# EAGLE design Screen v2 (EAGLE 9.2.0)
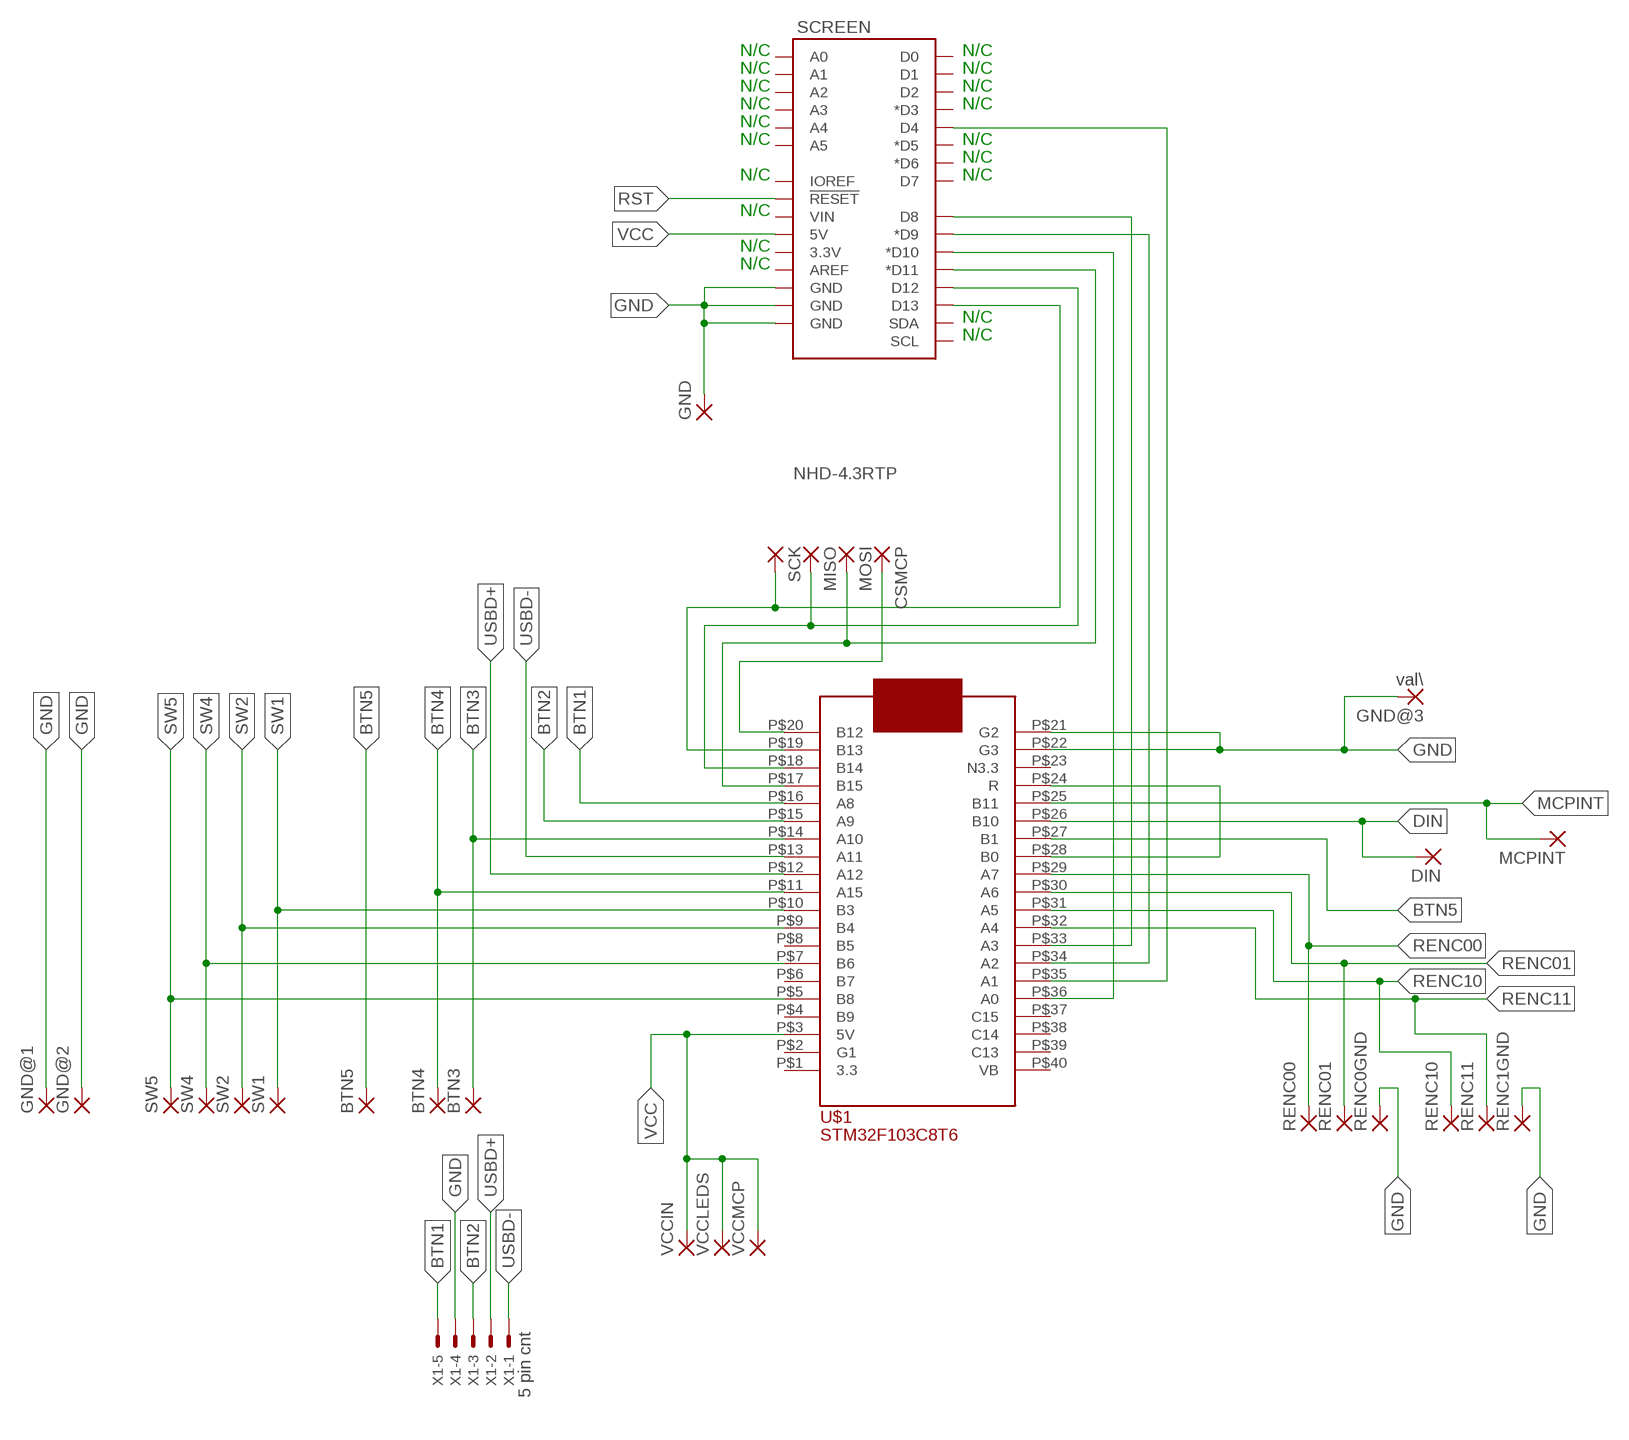
[diagram p0: schematic, sheet 1]

## Parts
BTN3  SMD5  [SMD2,54-5,08]
BTN4  SMD5  [SMD2,54-5,08]
BTN5  SMD5  [SMD2,54-5,08]
CSMCP  SMD5  [SMD2,54-5,08]
DIN  SMD5  [SMD2,54-5,08]
GND  SMD5  [SMD2,54-5,08]
GND@1  SMD5  [SMD2,54-5,08]
GND@2  SMD5  [SMD2,54-5,08]
GND@3  val\  SMD5  [SMD2,54-5,08]
MCPINT  SMD5  [SMD2,54-5,08]
MISO  SMD5  [SMD2,54-5,08]
MOSI  SMD5  [SMD2,54-5,08]
RENC00  SMD5  [SMD2,54-5,08]
RENC0GND  SMD5  [SMD2,54-5,08]
RENC01  SMD5  [SMD2,54-5,08]
RENC1GND  SMD5  [SMD2,54-5,08]
RENC10  SMD5  [SMD2,54-5,08]
RENC11  SMD5  [SMD2,54-5,08]
SCK  SMD5  [SMD2,54-5,08]
SCREEN  NHD-4.3RTP  [NHD-4.3RTP]
SW1  SMD5  [SMD2,54-5,08]
SW2  SMD5  [SMD2,54-5,08]
SW4  SMD5  [SMD2,54-5,08]
SW5  SMD5  [SMD2,54-5,08]
U$1  STM32F103C8T6DIP40  [STM32]
VCCIN  SMD5  [SMD2,54-5,08]
VCCLEDS  SMD5  [SMD2,54-5,08]
VCCMCP  SMD5  [SMD2,54-5,08]
X1  5 pin cnt  JST-XH-05-PIN-ROUND-PAD  [JST-XH-05-PACKAGE-ROUND-PAD]

## Nets
BTN1: U$1.P$16(A8) X1.5
BTN2: U$1.P$15(A9) X1.3
BTN3: BTN3.1(P) U$1.P$14(A10)
BTN4: BTN4.1(P) U$1.P$11(A15)
BTN5: BTN5.1(P) U$1.P$27(B1)
CS_SCREEN: SCREEN.D10(*D10) U$1.P$36(A0)
CSMCP: CSMCP.1(P) U$1.P$20(B12)
DIN: DIN.1(P) U$1.P$26(B10)
GND: GND.1(P) GND@1.1(P) GND@2.1(P) GND@3.1(P) RENC0GND.1(P) RENC1GND.1(P) SCREEN.GND@1(GND) SCREEN.GND@2(GND) SCREEN.GND@3(GND) U$1.P$21(G2) U$1.P$22(G3) X1.4
MCPINT: MCPINT.1(P) U$1.P$25(B11)
MISO: MISO.1(P) SCREEN.D12 U$1.P$18(B14)
MOSI: MOSI.1(P) SCREEN.D11(*D11) U$1.P$17(B15)
N$1: SCREEN.D4 U$1.P$35(A1)
N$2: SCREEN.D9(*D9) U$1.P$34(A2)
N$3: SCREEN.D8 U$1.P$33(A3)
N$13: U$1.P$24(R) U$1.P$28(B0)
RENC00: RENC00.1(P) U$1.P$29(A7)
RENC01: RENC01.1(P) U$1.P$30(A6)
RENC10: RENC10.1(P) U$1.P$31(A5)
RENC11: RENC11.1(P) U$1.P$32(A4)
RST: SCREEN.RESET@1(!RESET!)
SCK: SCK.1(P) SCREEN.D13 U$1.P$19(B13)
SW1: SW1.1(P) U$1.P$10(B3)
SW2: SW2.1(P) U$1.P$9(B4)
SW4: SW4.1(P) U$1.P$7(B6)
SW5: SW5.1(P) U$1.P$5(B8)
USBD+: U$1.P$12(A12) X1.2
USBD-: U$1.P$13(A11) X1.1
VCC: SCREEN.5V U$1.P$3(5V) VCCIN.1(P) VCCLEDS.1(P) VCCMCP.1(P)
Unconnected: SCREEN.3.3V SCREEN.A0 SCREEN.A1 SCREEN.A2 SCREEN.A3 SCREEN.A4 SCREEN.A5 SCREEN.AREF SCREEN.D0 SCREEN.D1 SCREEN.D2 SCREEN.D3(*D3) SCREEN.D5(*D5) SCREEN.D6(*D6) SCREEN.D7 SCREEN.IOREF SCREEN.SCL SCREEN.SDA SCREEN.VIN U$1.P$1(3.3) U$1.P$2(G1) U$1.P$4(B9) U$1.P$6(B7) U$1.P$8(B5) U$1.P$23(N3.3) U$1.P$37(C15) U$1.P$38(C14) U$1.P$39(C13) U$1.P$40(VB)

## Notes on the sheet
- N/C | N/C
- N/C | N/C
- N/C | N/C
- N/C | N/C
- N/C
- N/C | N/C
- N/C
- N/C | N/C
- N/C
- N/C
- N/C
- N/C
- N/C

## Library data of the parts
BTN3-BTN5 CSMCP DIN GND GND@1-GND@3 MCPINT MISO MOSI RENC00 RENC0GND RENC01 RENC1GND RENC10 RENC11 SCK SW1 SW2 SW4 SW5 VCCIN VCCLEDS VCCMCP = wirepad:SMD5: SMD PAD
SCREEN = Components:NHD-4.3RTP: Arduino R3 Footprint with SPI header Arduino Uno R3 Compatible Footprint. Matches PCB size of the original board. SparkFun Products: SAMD21 Dev Breakout <https://www.sparkfun.com/products/13672> RedBoard <https://www.sparkfun.com/products/12757> R3 Stackable Headers <https://www.sparkfun.com/products/11417>
U$1 = Components:STM32F103C8T6
X1 = Rembrandt Electronics - JST XH Connectors v1-0:JST-XH-05-PIN: JST XH Connector 2 Pin Wire to board connector. Pitch: 2,54 mm, (0.100") Number of pins: 5 Created by Rembrandt Electronics www.rembrandtelectronics.com

## Board
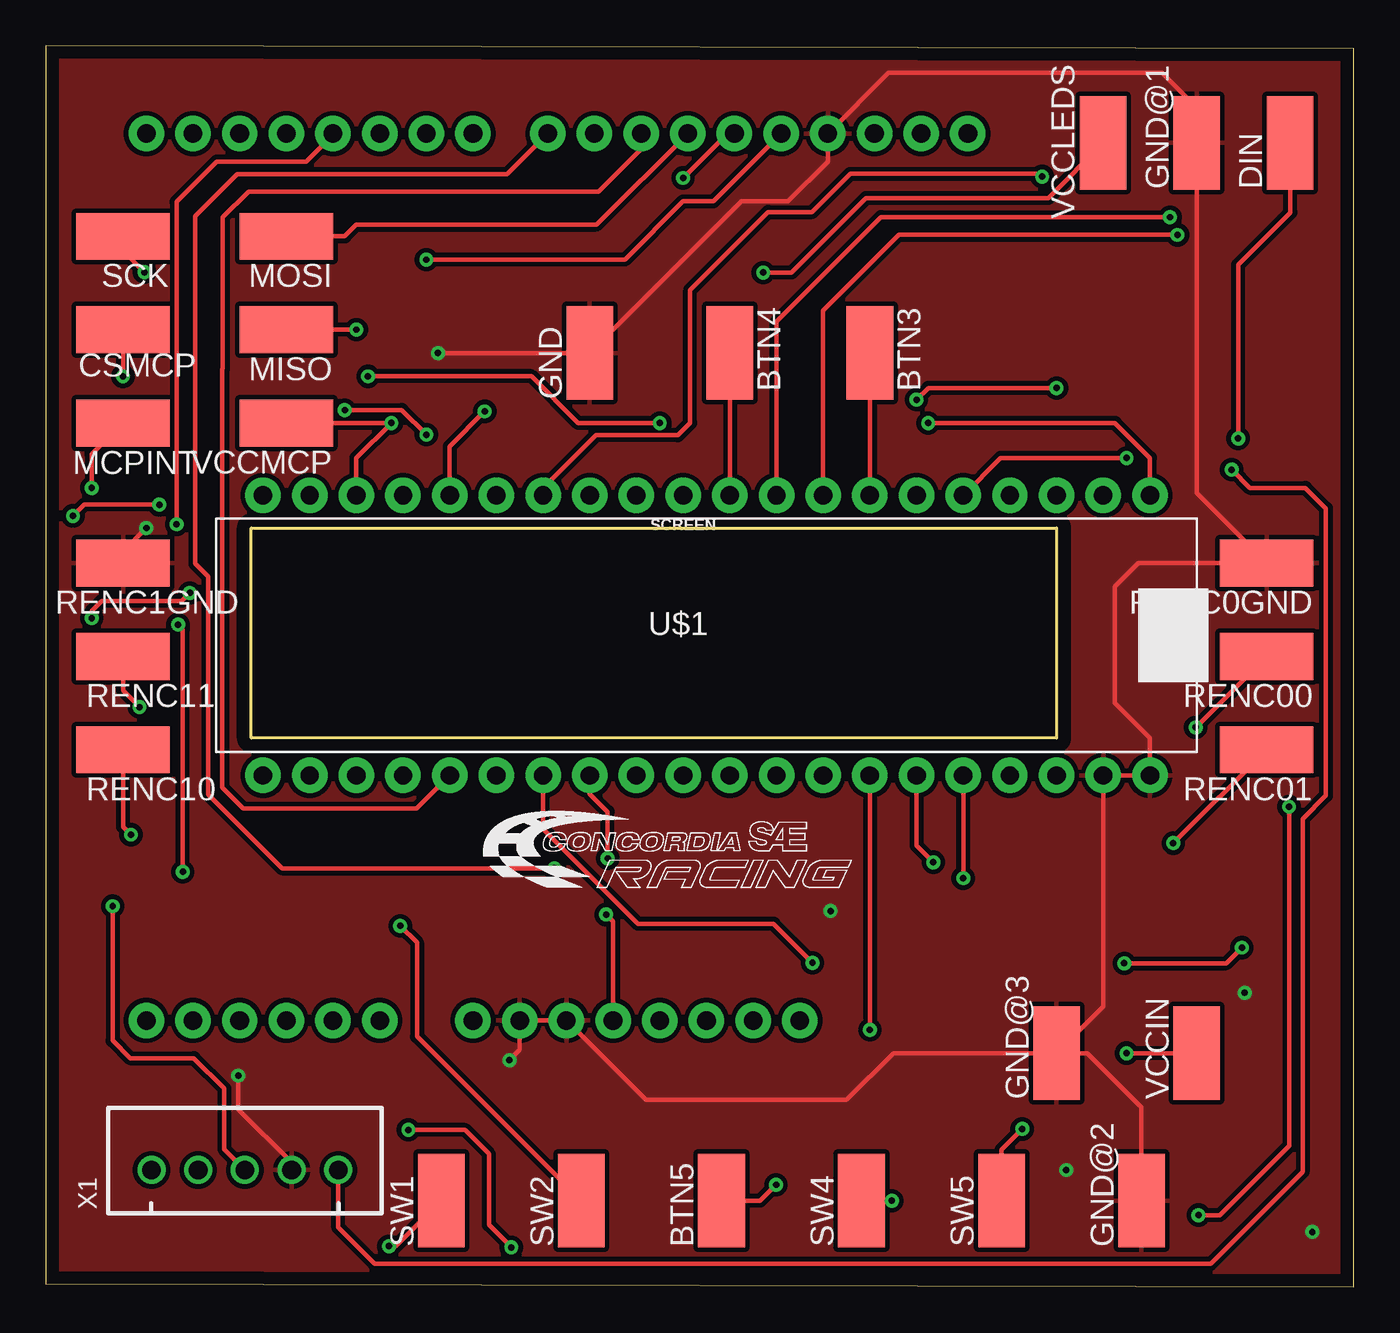
[diagram p1: board, top side]
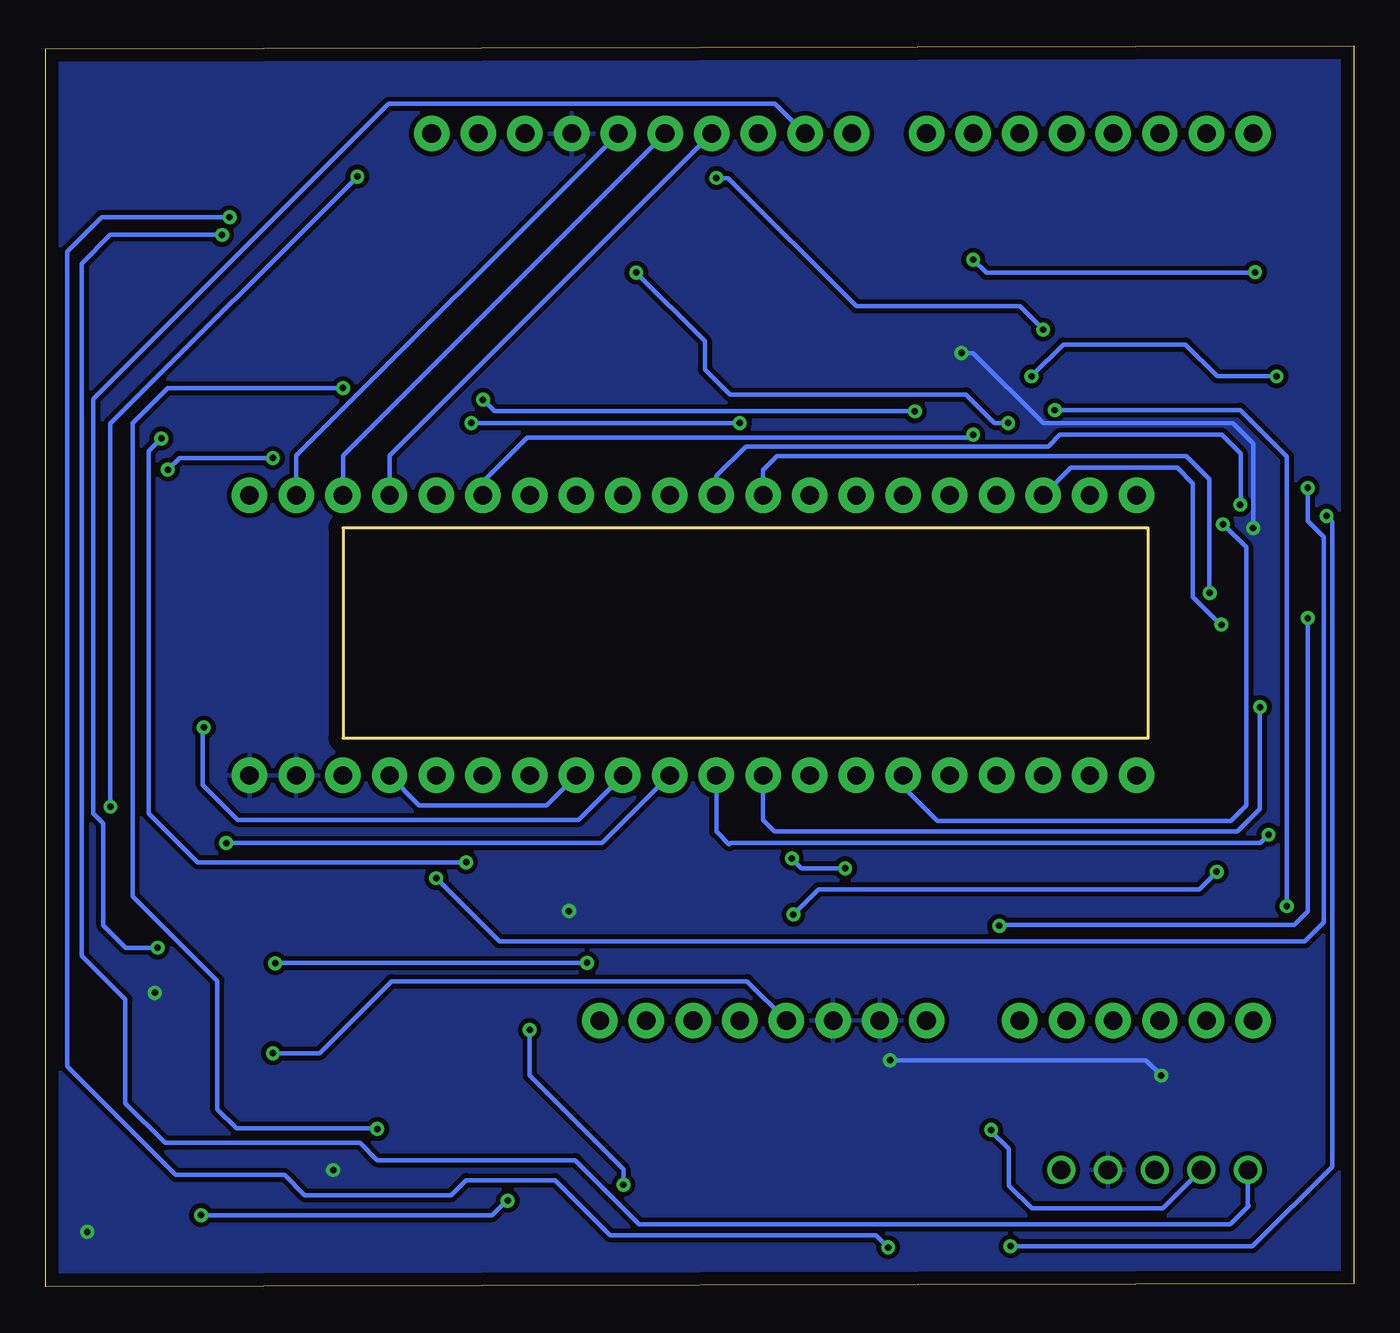
[diagram p2: board, bottom side, seen from below]

Size 71.15 x 67.51 mm. Coordinates in mm from the lower left corner, seen from the top.
Outline: 0,0.16 71.15,0 71.15,67.35 0,67.51 0,0.16
Outline: 11.18,41.27 54.99,41.27 54.99,29.84 11.18,29.84 11.18,41.27
Copper layers (1*16): Top 0.035mm / dielectric 1.5mm / Bottom 0.035mm
Design rules "default *": minimum track width 5mil, minimum drill 0.200659375mm, track to track 5mil, track to pad 5mil, pad to pad 5mil, via to via 5mil, smd to smd 0mil, copper to edge 28mil, drill to drill 6mil, minimum pad ring 10mil, minimum via ring 8mil, stop-mask expansion 5mil, vias tented up to drill 0mil, thermal gap 10mil

### Footprints (pad centres in the part's own frame; a part is rotated, then mirrored left to right if it is on the bottom)
SMD2,54-5,08 = smd 2.54 x 5.08: 1 0,0
NHD-4.3RTP = drill 1.016 pad 1.93: 3.3V 10.16,-24.13; 5V 7.62,-24.13; A0 -5.08,-24.13; A1 -7.62,-24.13; A2 -10.16,-24.13; A3 -12.7,-24.13; A4 -15.24,-24.13; A5 -17.78,-24.13; AREF 21.844,24.13; D0 -17.78,24.13; D1 -15.24,24.13; D2 -12.7,24.13; D3 -10.16,24.13; D4 -7.62,24.13; D5 -5.08,24.13; D6 -2.54,24.13; D7 0,24.13; D8 4.064,24.13; D9 6.604,24.13; D10 9.144,24.13; D11 11.684,24.13; D12 14.224,24.13; D13 16.764,24.13; GND@1 5.08,-24.13; GND@2 2.54,-24.13; GND@3 19.304,24.13; IOREF 15.24,-24.13; NC 17.78,-24.13; RESET@1 12.7,-24.13; SCL 26.924,24.13; SDA 24.384,24.13; VIN 0,-24.13
STM32 = drill 1 pad 1.93: P$1 -7.62,-20.955; P$2 -7.62,-18.415; P$3 -7.62,-15.875; P$4 -7.62,-13.335; P$5 -7.62,-10.795; P$6 -7.62,-8.255; P$7 -7.62,-5.715; P$8 -7.62,-3.175; P$9 -7.62,-0.635; P$10 -7.62,1.905; P$11 -7.62,4.445; P$12 -7.62,6.985; P$13 -7.62,9.525; P$14 -7.62,12.065; P$15 -7.62,14.605; P$16 -7.62,17.145; P$17 -7.62,19.685; P$18 -7.62,22.225; P$19 -7.62,24.765; P$20 -7.62,27.305; P$21 7.62,27.305; P$22 7.62,24.765; P$23 7.62,22.225; P$24 7.62,19.685; P$25 7.62,17.145; P$26 7.62,14.605; P$27 7.62,12.065; P$28 7.62,9.525; P$29 7.62,6.985; P$30 7.62,4.445; P$31 7.62,1.905; P$32 7.62,-0.635; P$33 7.62,-3.175; P$34 7.62,-5.715; P$35 7.62,-8.255; P$36 7.62,-10.795; P$37 7.62,-13.335; P$38 7.62,-15.875; P$39 7.62,-18.415; P$40 7.62,-20.955
JST-XH-05-PACKAGE-ROUND-PAD = drill 1.016: 1 -5.08,0; 2 -2.54,0; 3 0,0; 4 2.54,0; 5 5.08,0

### Placement (x,y rotation side)
BTN3  44.83,50.8 180 top
BTN4  37.21,50.8 180 top
BTN5  36.75,4.67 0 top
CSMCP  4.19,52.07 90 top
DIN  67.69,62.23 0 top
GND  29.59,50.8 0 top
GND@1  62.61,62.23 0 top
GND@2  59.61,4.67 0 top
GND@3  54.99,12.7 0 top
MCPINT  4.19,46.99 90 top
MISO  13.08,52.07 90 top
MOSI  13.08,57.15 90 top
RENC00  66.42,34.29 90 top
RENC0GND  66.42,39.37 90 top
RENC01  66.42,29.21 90 top
RENC1GND  4.19,39.37 90 top
RENC10  4.19,29.21 90 top
RENC11  4.19,34.29 90 top
SCK  4.19,57.15 90 top
SCREEN  23.24,38.61 0 top
SW1  21.51,4.67 0 top
SW2  29.13,4.67 0 top
SW4  44.37,4.67 0 top
SW5  51.99,4.67 0 top
U$1  32.77,35.43 270 top
VCCIN  62.61,12.7 0 top
VCCLEDS  57.53,62.23 0 top
VCCMCP  13.08,46.99 90 top
X1  10.83,6.34 0 top

### Tracks (layer width: path | path; a pad name or v marks a point on that pad's centre or on a via)
BTN1  (via drill 0.35)
  Top 0.254: v58.8,45.08 51.94,45.08 U$1.P$16 | v64.52,44.45 65.51,43.46 68.53,43.46 69.65,42.34 69.65,26.72 68.38,25.45 68.38,6.24 63.38,1.24 17.88,1.24 15.91,3.22 X1.5
  Bottom 0.254: v64.52,44.45 63.88,45.08 v58.8,45.08
BTN2  (via drill 0.35)
  Top 0.254: v16.26,47.69 19.36,47.69 v20.7,46.35 | v3.63,20.7 3.63,13.39 4.6,12.42 8.05,12.42 9.7,10.77 9.7,7.47 X1.3
  Bottom 0.254: U$1.P$15 47.37,43.81 44.98,46.2 20.85,46.2 v20.7,46.35 | v16.26,47.69 6.17,47.69 3.63,45.16 v3.63,20.7
BTN3
  Top 0.254: BTN3.1 U$1.P$14
BTN4
  Top 0.254: BTN4.1 U$1.P$11
BTN5  (via drill 0.35)
  Top 0.254: U$1.P$27 v44.83,13.97 | v39.73,5.54 38.86,4.67 BTN5.1
  Bottom 0.254: v39.73,5.54 39.73,6.38 44.83,11.48 v44.83,13.97
CS_SCREEN
  Top 0.254: SCREEN.D10 32.38,61.9 30.07,59.59 11.02,59.59 9.63,58.19 9.63,49.94 9.6,49.91 9.6,27.15 10.74,26.01 20.17,26.01 U$1.P$36
CSMCP  (via drill 0.35)
  Top 0.254: U$1.P$20 60.07,45.08 58.17,46.99 v48.01,46.99 | v33.4,46.99 28.96,46.99 26.42,49.53 v17.53,49.53 | v4.19,49.53 CSMCP.1
  Bottom 0.254: v48.01,46.99 v33.4,46.99 | v17.53,49.53 15.8,51.26 9.14,51.26 7.42,49.53 v4.19,49.53
DIN  (via drill 0.35)
  Top 0.254: U$1.P$26 47.37,24 v48.29,23.09 | v64.87,46.15 64.87,55.6 67.72,58.45 67.72,62.2 DIN.1
  Bottom 0.254: v48.29,23.09 62.89,23.09 65.56,25.76 65.56,45.47 v64.87,46.15
GND  (via drill 0.35)
  Top 0.254: GND@3.1 46.1,12.7 43.56,10.16 32.64,10.16 SCREEN.GND@1 SCREEN.GND@2 25.78,12.88 v25.22,12.32 | GND@3.1 57.53,15.24 U$1.P$22 U$1.P$21 60.07,29.84 58.17,31.75 58.17,38.1 59.44,39.37 RENC0GND.1 62.61,43.18 GND@1.1 62.61,64.13 60.71,66.04 45.85,66.04 SCREEN.GND@3 42.54,61.21 40.39,59.05 37.85,59.05 GND.1 v21.34,50.8 | v5.46,41.27 4.19,40 RENC1GND.1 | GND@2.1 59.61,9.75 56.67,12.7 GND@3.1 | v10.46,11.48 10.46,9.66 13.37,6.76 X1.4
  Bottom 0.254: v21.34,50.8 20.7,50.8 16.89,46.99 6.58,46.99 5.46,45.87 v5.46,41.27 | v25.22,12.32 11.3,12.32 v10.46,11.48
  other vias: 42.69,20.43 55.51,6.34 65.22,15.99 68.91,2.97
  pour Bottom (isolate 0.254): -10.11,76.32 -10.11,-10.04 81.33,-10.04 81.33,76.32
  pour Top (isolate 0.254): -5.03,71.24 -5.03,-4.96 76.25,-4.96 76.25,71.24
MCPINT  (via drill 0.35)
  Top 0.254: v49.91,22.22 U$1.P$25 | MCPINT.1 2.49,45.29 v2.49,43.46
  Bottom 0.254: v49.91,22.22 46.47,18.79 2.65,18.79 1.63,19.81 1.63,40.79 2.49,41.66 v2.49,43.46
MISO  (via drill 0.35)
  Top 0.254: SCREEN.D12 37.08,62.74 v34.67,60.32 | v16.89,52.07 MISO.1
  Bottom 0.254: v34.67,60.32 34.04,60.32 27.05,53.34 18.16,53.34 v16.89,52.07 | SCREEN.D12 54.99,45.21 U$1.P$18
MOSI
  Top 0.254: MOSI.1 16.26,57.15 16.89,57.78 29.97,57.78 SCREEN.D11
  Bottom 0.254: SCREEN.D11 52.45,45.21 U$1.P$17
N$1  (via drill 0.35)
  Top 0.254: SCREEN.D4 15.62,62.69 14.15,61.21 9.3,61.21 7.11,59.03 v7.11,41.48
  Bottom 0.254: U$1.P$35 24.51,27.2 22.66,25.35 6.68,25.35 5.85,26.18 5.85,40.24 7.09,41.48 v7.11,41.48
N$2  (via drill 0.35)
  Top 0.254: v41.71,17.62 39.59,19.74 32.21,19.74 27.05,24.89 U$1.P$34 | v58.67,17.59 64.23,17.59 v65.07,18.44
  Bottom 0.254: v58.67,17.59 58.65,17.62 v41.71,17.62 | SCREEN.D9 31.47,64.36 52.5,64.36 68.58,48.29 68.58,25.76 68.02,25.2 68.02,19.66 66.8,18.44 v65.07,18.44
N$3  (via drill 0.35)
  Top 0.254: SCREEN.D8 25.09,60.53 10.41,60.53 8.13,58.24 8.13,39.33 8.83,38.63 8.83,26.78 12.85,22.76 v27.66,22.76 | v30.57,23.3 30.57,25.83 29.59,26.81 U$1.P$33
  Bottom 0.254: v27.66,22.76 30.03,22.76 v30.57,23.3
N$13
  Bottom 0.254: U$1.P$28 43.91,26.19 50.84,26.19 U$1.P$24
RENC00  (via drill 0.35)
  Top 0.254: v62.56,30.43 RENC00.1
  Bottom 0.254: U$1.P$29 42.16,25.4 60.71,25.4 62.61,27.3 62.61,30.38 v62.56,30.43
RENC01  (via drill 0.35)
  Top 0.254: v61.34,24.13 RENC01.1
  Bottom 0.254: v61.34,24.13 40.89,24.13 U$1.P$30
RENC10  (via drill 0.35)
  Top 0.254: v4.63,24.59 4.19,25.02 RENC10.1
  Bottom 0.254: U$1.P$31 34.67,24.76 33.97,24.07 33.91,24.13 5.08,24.13 v4.63,24.59
RENC11  (via drill 0.35)
  Top 0.254: v5.09,31.53 4.19,32.43 RENC11.1
  Bottom 0.254: U$1.P$32 32.13,25.4 31.5,24.76 6.32,24.76 5.09,26 v5.09,31.53
SCK  (via drill 0.35)
  Top 0.254: v20.7,55.88 31.5,55.88 34.67,59.05 36.32,59.05 SCREEN.D13 | v5.36,55.19 4.19,56.36 SCK.1
  Bottom 0.254: SCREEN.D13 57.53,45.21 U$1.P$19 | v20.7,55.88 19.99,55.17 5.38,55.17 v5.36,55.19
SW1  (via drill 0.35)
  Top 0.254: v6.17,42.54 2.08,42.54 v1.47,41.94 | v18.66,2.19 19.03,2.19 SW1.1
  Bottom 0.254: v1.47,41.94 1.17,41.63 1.17,6.53 5.5,2.19 v18.66,2.19 | v6.17,42.54 6.15,42.56 6.15,45.34 7.16,46.35 15.98,46.35 16.61,45.72 33.07,45.72 34.67,44.12 U$1.P$10
SW2  (via drill 0.35)
  Top 0.254: v7.82,37.74 7.39,37.31 3.05,37.31 2.49,36.75 v2.49,36.37 | v19.28,19.63 20.19,18.72 20.19,13.61 SW2.1
  Bottom 0.254: v2.49,36.37 2.49,26.21 2.49,20.42 3.23,19.68 19.22,19.68 v19.28,19.63 | U$1.P$9 32.13,44.42 31.37,45.19 9.09,45.19 7.85,43.94 7.85,37.77 v7.82,37.74
SW4  (via drill 0.35)
  Top 0.254: v67.64,26.11 67.64,7.66 63.87,3.89 v62.71,3.89 | U$1.P$7 27.05,43.46 29.92,46.33 34.39,46.33 35.05,46.99 35.05,54.23 39.29,58.47 41.68,58.47 43.76,60.55 54.05,60.55 v54.2,60.4 | v46.02,4.67 SW4.1
  Bottom 0.254: v67.64,26.11 67.64,46.96 v54.2,60.4 | v62.71,3.89 46.86,3.89 46.08,4.67 v46.02,4.67
SW5  (via drill 0.35)
  Top 0.254: v54.99,48.89 48.01,48.89 v47.37,48.26 | v23.88,47.62 21.97,45.72 U$1.P$5 | v53.12,8.57 51.99,7.45 SW5.1
  Bottom 0.254: v54.99,48.89 64.52,48.89 66.42,46.99 66.42,21.23 61.82,16.64 61.82,9.66 60.77,8.6 53.15,8.6 v53.12,8.57 | v47.37,48.26 46.74,47.62 v23.88,47.62
USBD+  (via drill 0.35)
  Top 0.254: U$1.P$12 39.75,52.5 45.44,58.19 v61.16,58.19 | v25.32,2.13 24.1,3.35 24.1,7.21 22.79,8.52 v19.72,8.52
  Bottom 0.254: v61.16,58.19 68.12,58.19 70,56.31 70,11.99 64.08,6.07 58.17,6.07 57.07,4.98 49.1,4.98 48.29,5.79 43.46,5.79 40.46,2.79 25.98,2.79 v25.32,2.13 | X1.2 10.38,4.25 17.51,4.25 18.76,5.5 18.76,7.49 19.72,8.45 v19.72,8.52
USBD-  (via drill 0.35)
  Top 0.254: U$1.P$13 42.29,53.11 46.41,57.23 v61.57,57.23
  Bottom 0.254: v61.57,57.23 67.64,57.23 69.2,55.66 69.2,18 66.83,15.62 66.83,9.98 64.66,7.81 54.06,7.81 53.12,6.87 42.36,6.87 38.88,3.39 6.71,3.39 5.7,4.4 5.75,4.44 X1.1
VCC  (via drill 0.35)
  Top 0.254: VCCIN.1 v58.8,12.7 | U$1.P$3 16.89,45.08 v18.8,46.99 VCCMCP.1 | v7.44,22.57 7.44,35.76 v7.19,36.02 | v30.48,20.24 30.86,19.86 SCREEN.5V | VCCLEDS.1 54.53,59.23 44.63,59.23 40.57,55.17 v39.03,55.17
  Bottom 0.254: v58.8,12.7 56.26,12.7 52.34,16.62 33,16.62 SCREEN.5V | v18.8,46.99 19.53,46.99 21.08,48.54 33.94,48.54 35.3,49.9 35.3,51.44 v39.03,55.17 | U$1.P$3 15.39,44.55 9.6,44.55 8.74,43.69 8.74,37.52 7.24,36.02 v7.19,36.02 | v7.44,22.57 8.39,21.62 29.1,21.62 v30.48,20.24